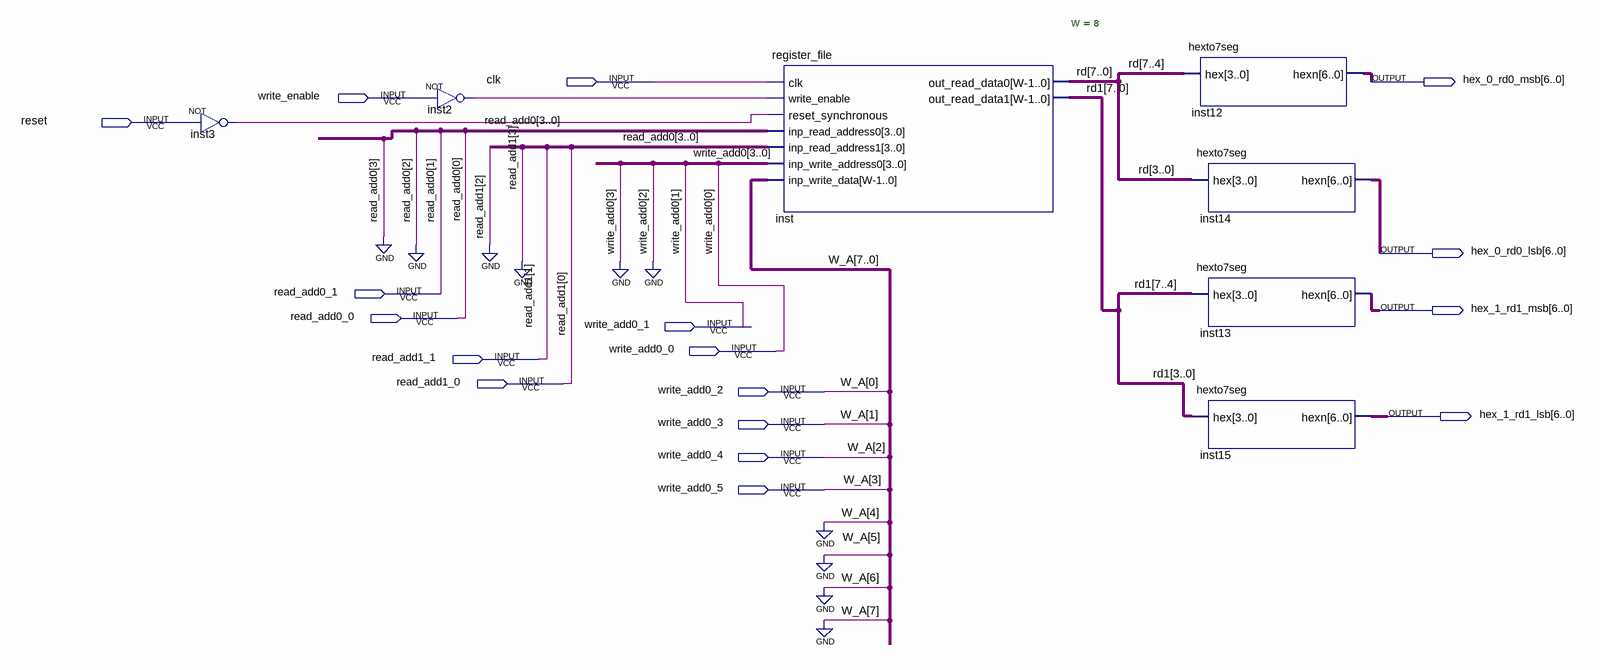
[diagram p0: schematic sheet]
// Quartus schematic Q1.bdf as structural Verilog: 7 symbols, 17 pins
module Q1 (
  input  clk,
  input  write_enable,
  input  reset,
  input  read_add0_1,
  input  read_add0_0,
  input  write_add0_1,
  input  write_add0_0,
  input  read_add1_1,
  input  read_add1_0,
  input  write_add0_2,
  input  write_add0_3,
  input  write_add0_4,
  input  write_add0_5,
  output [6:0] hex_0_rd0_msb,
  output [6:0] hex_0_rd0_lsb,
  output [6:0] hex_1_rd1_msb,
  output [6:0] hex_1_rd1_lsb
);

  wire inst2_out, inst3_out;
  wire [7:0] rd, rd1;

  not inst3 (inst3_out, reset);
  not inst2 (inst2_out, write_enable);
  register_file #(.W(8)) inst (
    .clk(clk), .write_enable(inst2_out), .reset_synchronous(inst3_out),
    .inp_read_address0({2'b00, read_add0_1, read_add0_0}),
    .inp_read_address1({2'b00, read_add0_1, read_add0_0}),
    .inp_write_address0({2'b00, write_add0_1, write_add0_0}),
    .inp_write_data({4'b0000, write_add0_5, write_add0_4, write_add0_3, write_add0_2}), .out_read_data0(rd),
    .out_read_data1(rd1));
  hexto7seg inst12 (.hex(rd[7:4]), .hexn(hex_0_rd0_msb));
  hexto7seg inst14 (.hex(rd[3:0]), .hexn(hex_0_rd0_lsb));
  hexto7seg inst13 (.hex(rd1[7:4]), .hexn(hex_1_rd1_msb));
  hexto7seg inst15 (.hex(rd1[3:0]), .hexn(hex_1_rd1_lsb));

  // Other names for the same wires on the sheet: read_add0[1:0] = {read_add0_1, read_add0_0};
  //   read_add1[1:0] = {read_add1_1, read_add1_0};
  //   W_A[3:0] = {write_add0_5, write_add0_4, write_add0_3, write_add0_2};
  //   write_add0[1:0] = {write_add0_1, write_add0_0}
endmodule
